# EAGLE schematic radio_module (EAGLE 6.6.0)
AUTHOR: Joshua Adkins; REV: A; TITLE: Radio Module

## Sheet 1 of 5
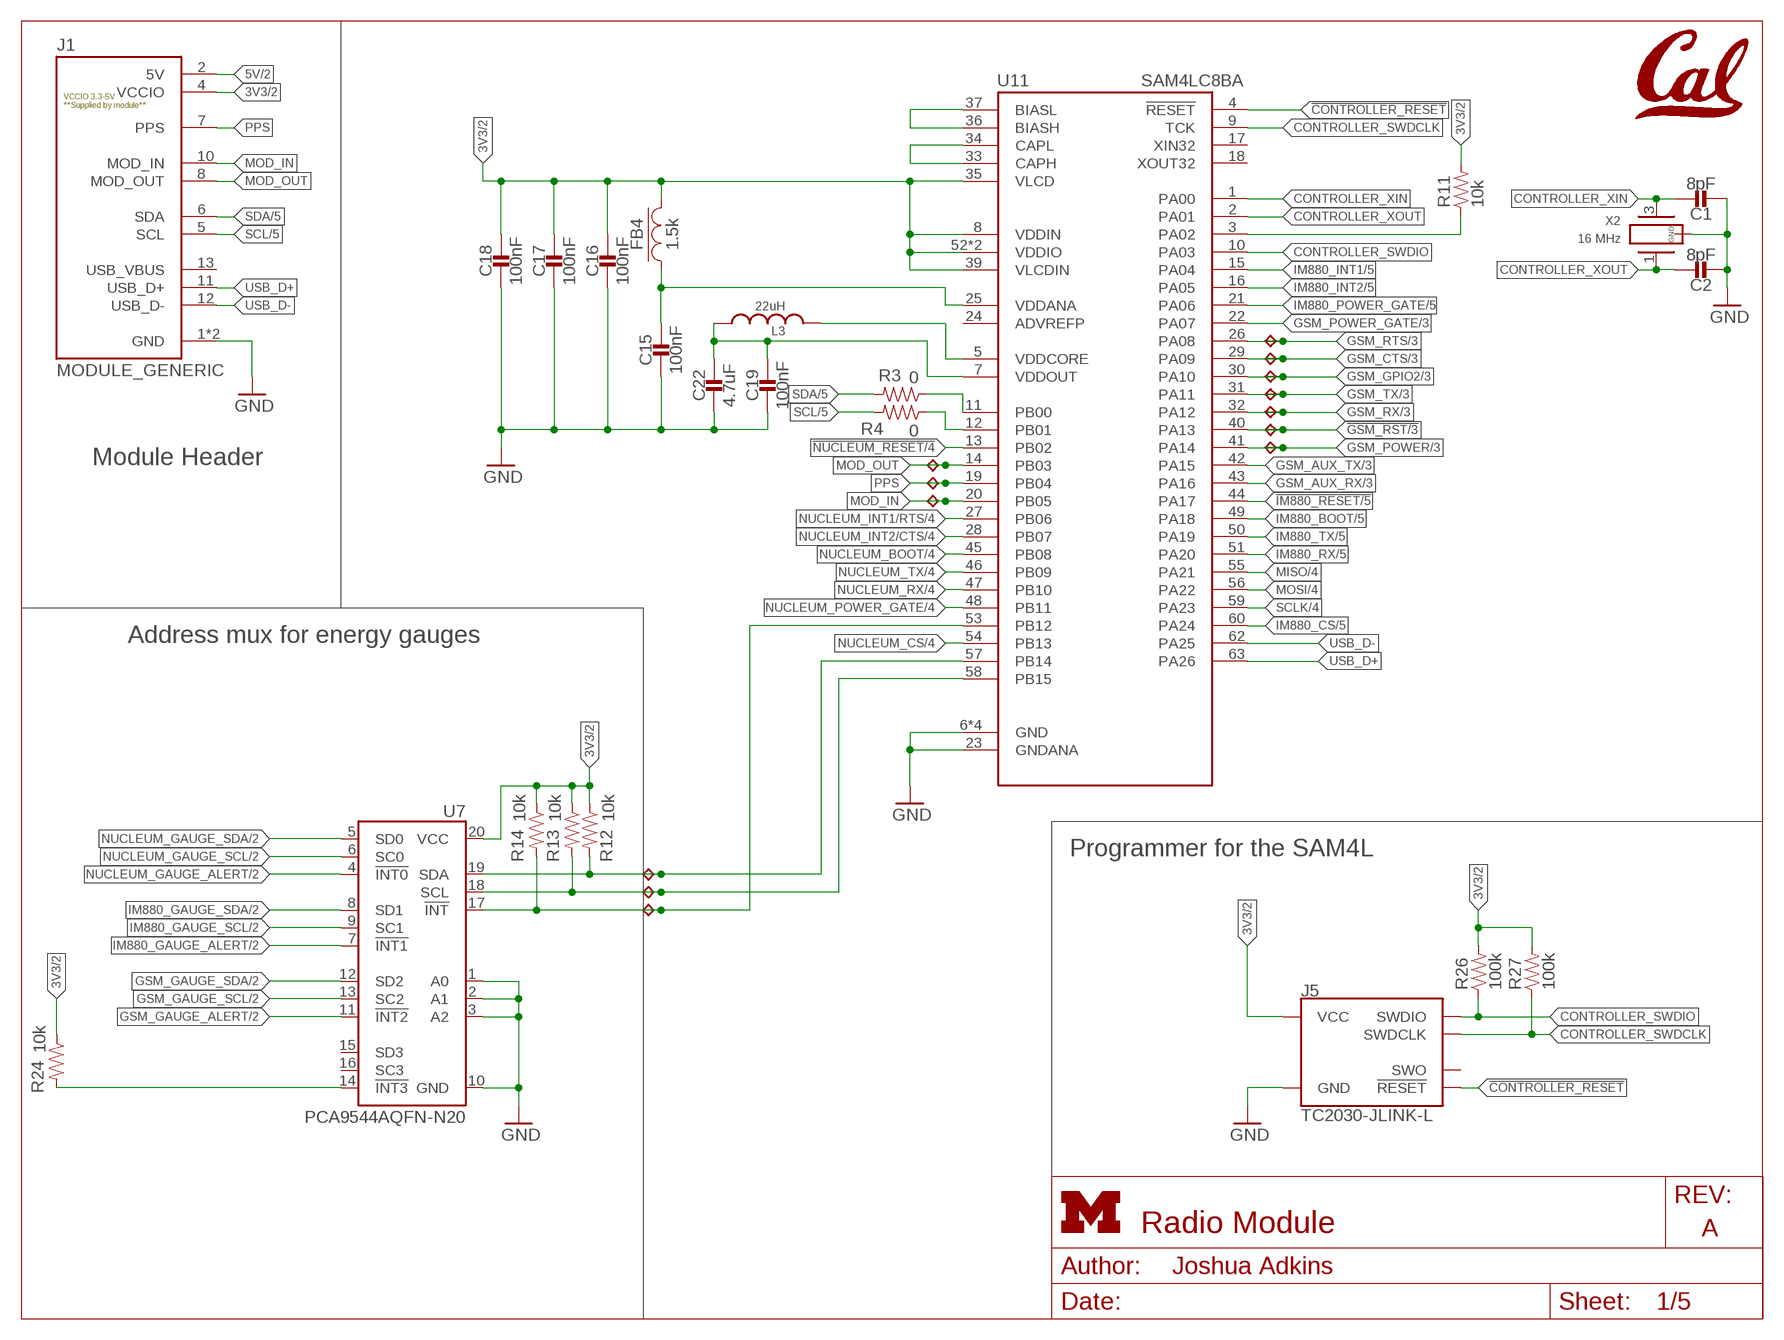
[diagram p0: schematic, sheet 1]
FRAME2 (LETTER_L_UMICH): HEIGHT: 8.5in; WIDTH: 11in

### Parts
C1  8pF  CAPACITOR0402_CAP  [0402_CAP]
C2  8pF  CAPACITOR0402_CAP  [0402_CAP]
C15  100nF  CAPACITOR0402_CAP  [0402_CAP]
C16  100nF  CAPACITOR0402_CAP  [0402_CAP]
C17  100nF  CAPACITOR0402_CAP  [0402_CAP]
C18  100nF  CAPACITOR0402_CAP  [0402_CAP]
C19  100nF  CAPACITOR0402_CAP  [0402_CAP]
C22  4.7uF  CAPACITOR0402_CAP  [0402_CAP]
FB4  1.5k  FERRITE_BEAD0402  [0402_CAP]
J1  MODULE_GENERIC  [MODULE_GENERIC]
J5  TC2030-JLINK-L  [TC2030-IDC]
L3  22uH  LHQ3NP  [1212]
R3  0  RESISTOR0402_RES  [0402_RES]
R4  0  RESISTOR0402_RES  [0402_RES]
R11  10k  RESISTOR0402_RES  [0402_RES]
R12  10k  RESISTOR0402_RES  [0402_RES]
R13  10k  RESISTOR0402_RES  [0402_RES]
R14  10k  RESISTOR0402_RES  [0402_RES]
R24  10k  RESISTOR0402_RES  [0402_RES]
R26  100k  RESISTOR0402_RES  [0402_RES]
R27  100k  RESISTOR0402_RES  [0402_RES]
TP1  TPB1,27  [B1,27]
TP2  TPB1,27  [B1,27]
TP3  TPB1,27  [B1,27]
TP4  TPB1,27  [B1,27]
TP5  TPB1,27  [B1,27]
TP6  TPB1,27  [B1,27]
TP7  TPB1,27  [B1,27]
TP8  TPB1,27  [B1,27]
TP9  TPB1,27  [B1,27]
TP10  TPB1,27  [B1,27]
TP11  TPB1,27  [B1,27]
TP12  TPB1,27  [B1,27]
TP13  TPB1,27  [B1,27]
U7  PCA9544AQFN-N20  [QFN-N20]
U11  SAM4LC8BA  [QFN-64-9MM]
U$1  UCB_CAL100MIL  [UCB_CAL_100MIL]
X2  16 MHz  FH1600015  [FHXXX]

### Nets
3V3: C16.1 C17.1 C18.1 FB4.2 J1.4(VCCIO) J5.1(VCC) R11.2 R12.1 R13.1 R14.1 R24.1 R26.2 R27.2 U7.20(VCC) U11.8(VDDIN) U11.35(VLCD) U11.39(VLCDIN) U11.52(VDDIO) U11.61(VDDIO) ; also sheet 2,3
5V: J1.2(5V) ; also sheet 2
!CONTROLLER_RESET: J5.3(!RESET) U11.4(!RESET)
!GSM_RST: TP7.TP U11.40(PA13) ; also sheet 3
!IM880_RESET: U11.44(PA17) ; also sheet 5
!NUCLEUM_RESET: U11.13(PB02) ; also sheet 4
CONTROLLER_BUCK/LDO_N: R11.1 U11.3(PA02)
CONTROLLER_SWDCLK: J5.4(SWDCLK) R27.1 U11.9(TCK)
CONTROLLER_SWDIO: J5.2(SWDIO) R26.1 U11.10(PA03)
CONTROLLER_XIN: C1.1 U11.1(PA00) X2.3
CONTROLLER_XOUT: C2.1 U11.2(PA01) X2.1
GND: C1.2 C2.2 C15.2 C16.2 C17.2 C18.2 C19.2 C22.2 J1.1(GND) J1.14(GND) J5.5(GND) U7.1(A0) U7.2(A1) U7.3(A2) U7.10(GND) U11.6(GND) U11.23(GNDANA) U11.38(GND) U11.64(GND) U11.GND X2.2(GND) X2.4(GND) ; also sheet 2,3,4,5
GSM_AUX_RX: U11.43(PA16) ; also sheet 3
GSM_AUX_TX: U11.42(PA15) ; also sheet 3
GSM_CTS: TP11.TP U11.29(PA09) ; also sheet 3
GSM_GAUGE_ALERT: U7.11(!INT2) ; also sheet 2
GSM_GAUGE_SCL: U7.13(SC2) ; also sheet 2
GSM_GAUGE_SDA: U7.12(SD2) ; also sheet 2
GSM_GPIO2: TP10.TP U11.30(PA10) ; also sheet 3
GSM_POWER: TP6.TP U11.41(PA14) ; also sheet 3
GSM_POWER_GATE: U11.22(PA07) ; also sheet 3
GSM_RTS: TP12.TP U11.26(PA08) ; also sheet 3
GSM_RX: TP8.TP U11.32(PA12) ; also sheet 3
GSM_TX: TP9.TP U11.31(PA11) ; also sheet 3
IM880_BOOT: U11.49(PA18) ; also sheet 5
IM880_CS: U11.60(PA24) ; also sheet 5
IM880_GAUGE_ALERT: U7.7(!INT1) ; also sheet 2
IM880_GAUGE_SCL: U7.9(SC1) ; also sheet 2
IM880_GAUGE_SDA: U7.8(SD1) ; also sheet 2
IM880_INT1: U11.15(PA04) ; also sheet 5
IM880_INT2: U11.16(PA05) ; also sheet 5
IM880_POWER_GATE: U11.21(PA06) ; also sheet 5
IM880_RX: U11.51(PA20) ; also sheet 5
IM880_TX: U11.50(PA19) ; also sheet 5
MISO: U11.55(PA21) ; also sheet 4,5
MOD_IN: J1.10(MOD_IN) TP3.TP U11.20(PB05)
MOD_OUT: J1.8(MOD_OUT) TP1.TP U11.14(PB03)
MOSI: U11.56(PA22) ; also sheet 4,5
N$9: R14.2 TP13.TP U7.17(!INT) U11.53(PB12)
N$12: R24.2 U7.14(!INT3)
N$17: R3.1 U11.11(PB00)
N$18: R4.1 U11.12(PB01)
N$33: C15.1 FB4.1 U11.25(VDDANA)
N$44: C19.1 C22.1 L3.P$1 U11.7(VDDOUT)
N$52: L3.P$2 U11.5(VDDCORE)
N$53: U11.36(BIASH) U11.37(BIASL)
N$54: U11.33(CAPH) U11.34(CAPL)
NUCLEUM_BOOT: U11.45(PB08) ; also sheet 4
NUCLEUM_CS: U11.54(PB13) ; also sheet 4
NUCLEUM_GAUGE_ALERT: U7.4(!INT0) ; also sheet 2
NUCLEUM_GAUGE_SCL: U7.6(SC0) ; also sheet 2
NUCLEUM_GAUGE_SDA: U7.5(SD0) ; also sheet 2
NUCLEUM_INT1/RTS: U11.27(PB06) ; also sheet 4
NUCLEUM_INT2/CTS: U11.28(PB07) ; also sheet 4
NUCLEUM_POWER_GATE: U11.48(PB11) ; also sheet 4
NUCLEUM_RX: U11.47(PB10) ; also sheet 4
NUCLEUM_TX: U11.46(PB09) ; also sheet 4
PPS: J1.7(PPS) TP2.TP U11.19(PB04)
SCL: J1.5(SCL) R4.2 ; also sheet 5
SCL_INTERNAL: R13.2 TP5.TP U7.18(SCL) U11.58(PB15)
SCLK: U11.59(PA23) ; also sheet 4,5
SDA: J1.6(SDA) R3.2 ; also sheet 5
SDA_INTERNAL: R12.2 TP4.TP U7.19(SDA) U11.57(PB14)
USB_D+: J1.11(USB_D+) U11.63(PA26)
USB_D-: J1.12(USB_D-) U11.62(PA25)
Unconnected: J1.13(USB_VBUS) J5.6(SWO) U7.15(SD3) U7.16(SC3) U11.17(XIN32) U11.18(XOUT32)

### Notes on the sheet
- Module Header
- Address mux for energy gauges
- Programmer for the SAM4L

## Sheet 2 of 5
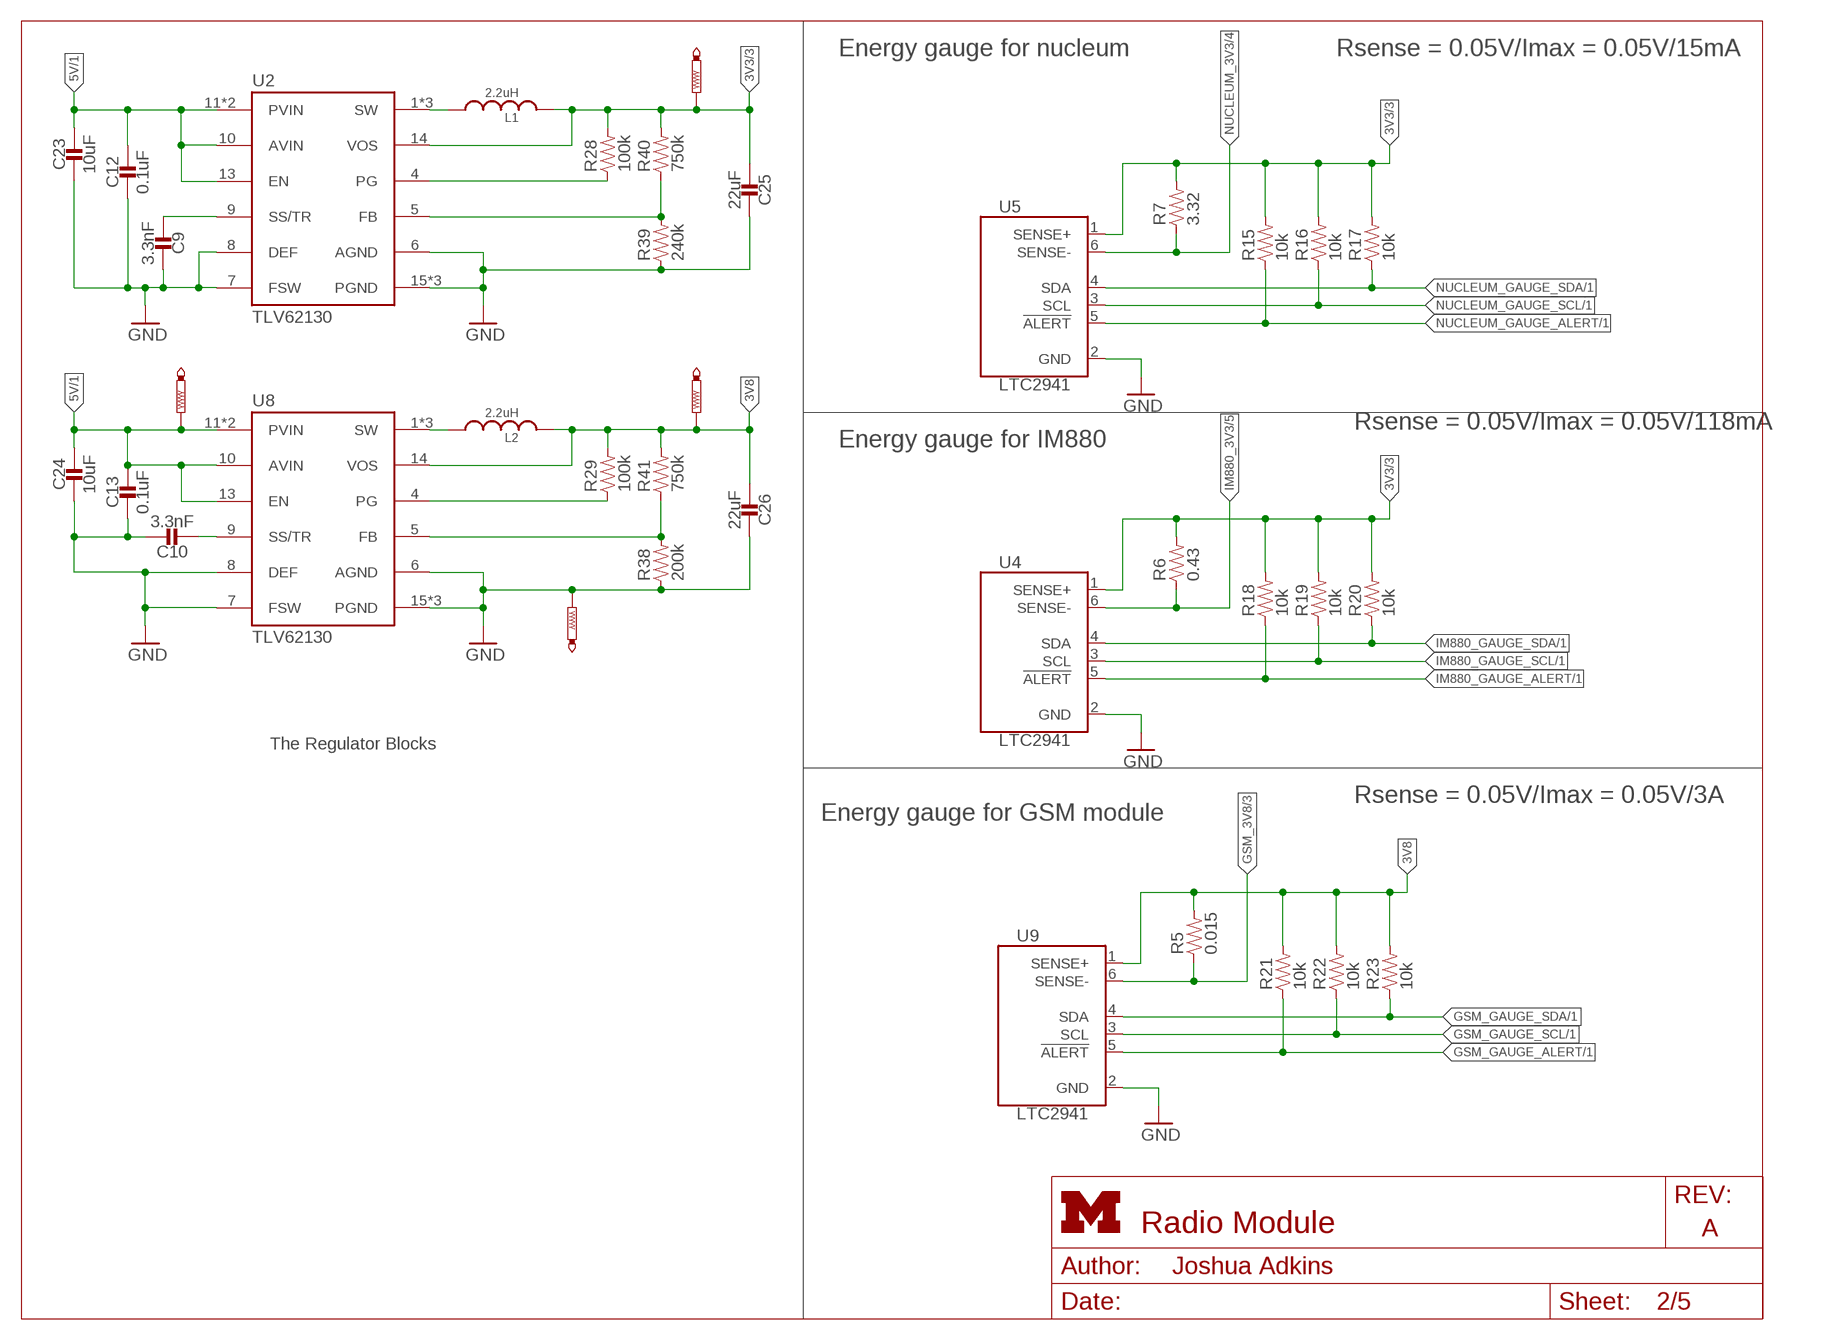
[diagram p1: schematic, sheet 2]
FRAME5 (LETTER_L_UMICH): HEIGHT: 8.5in; WIDTH: 11in

### Parts
C9  3.3nF  CAPACITOR0402_CAP  [0402_CAP]
C10  3.3nF  CAPACITOR0402_CAP  [0402_CAP]
C12  0.1uF  CAPACITOR0402_CAP  [0402_CAP]
C13  0.1uF  CAPACITOR0402_CAP  [0402_CAP]
C23  10uF  CAPACITOR0402_CAP  [0402_CAP]
C24  10uF  CAPACITOR0402_CAP  [0402_CAP]
C25  22uF  CAPACITOR0402_CAP  [0402_CAP]
C26  22uF  CAPACITOR0402_CAP  [0402_CAP]
L1  2.2uH  INDUCTORIHL  [IHL-1212BZ-11]
L2  2.2uH  INDUCTORIHL  [IHL-1212BZ-11]
R5  0.015  RESISTOR0603_RES  [0603-RES]
R6  0.43  RESISTOR0402_RES  [0402_RES]
R7  3.32  RESISTOR0402_RES  [0402_RES]
R15  10k  RESISTOR0402_RES  [0402_RES]
R16  10k  RESISTOR0402_RES  [0402_RES]
R17  10k  RESISTOR0402_RES  [0402_RES]
R18  10k  RESISTOR0402_RES  [0402_RES]
R19  10k  RESISTOR0402_RES  [0402_RES]
R20  10k  RESISTOR0402_RES  [0402_RES]
R21  10k  RESISTOR0402_RES  [0402_RES]
R22  10k  RESISTOR0402_RES  [0402_RES]
R23  10k  RESISTOR0402_RES  [0402_RES]
R28  100k  RESISTOR0402_RES  [0402_RES]
R29  100k  RESISTOR0402_RES  [0402_RES]
R38  200k  RESISTOR0402_RES  [0402_RES]
R39  240k  RESISTOR0402_RES  [0402_RES]
R40  750k  RESISTOR0402_RES  [0402_RES]
R41  750k  RESISTOR0402_RES  [0402_RES]
TP14  PTR1PAD1-13  [P1-13]
TP15  PTR1PAD1-13  [P1-13]
TP16  PTR1PAD1-13  [P1-13]
TP17  PTR1PAD1-13  [P1-13]
U2  TLV62130  [TQFN-16/3MM]
U4  LTC2941  [DFN-6-2MMX3MM]
U5  LTC2941  [DFN-6-2MMX3MM]
U8  TLV62130  [TQFN-16/3MM]
U9  LTC2941  [DFN-6-2MMX3MM]

### Nets
3V3: C25.2 L1.P$2 R6.2 R7.2 R15.2 R16.2 R17.2 R18.2 R19.2 R20.2 R28.2 R40.2 TP17.TP U2.14(VOS) U4.1(SENSE+) U5.1(SENSE+) ; also sheet 1,3
3V8: C26.2 L2.P$2 R5.2 R21.2 R22.2 R23.2 R29.2 R41.2 TP14.TP U8.14(VOS) U9.1(SENSE+)
3V8SWOUT: L2.P$1 U8.1(SW) U8.2(SW) U8.3(SW)
3VSWOUT: L1.P$1 U2.1(SW) U2.2(SW) U2.3(SW)
5V: C12.1 C13.1 C23.1 C24.1 TP16.TP U2.10(AVIN) U2.11(PVIN) U2.12(PVIN) U2.13(EN) U8.10(AVIN) U8.11(PVIN) U8.12(PVIN) U8.13(EN) ; also sheet 1
GND: C9.1 C10.1 C12.2 C13.2 C23.2 C24.2 C25.1 C26.1 R38.1 R39.1 TP15.TP U2.6(AGND) U2.7(FSW) U2.8(DEF) U2.15(PGND) U2.16(PGND) U2.GND U4.2(GND) U5.2(GND) U8.6(AGND) U8.7(FSW) U8.8(DEF) U8.15(PGND) U8.16(PGND) U8.GND U9.2(GND) ; also sheet 1,3,4,5
GSM_3V8: R5.1 U9.6(SENSE-) ; also sheet 3
GSM_GAUGE_ALERT: R21.1 U9.5(!ALERT) ; also sheet 1
GSM_GAUGE_SCL: R22.1 U9.3(SCL) ; also sheet 1
GSM_GAUGE_SDA: R23.1 U9.4(SDA) ; also sheet 1
IM880_3V3: R6.1 U4.6(SENSE-) ; also sheet 5
IM880_GAUGE_ALERT: R18.1 U4.5(!ALERT) ; also sheet 1
IM880_GAUGE_SCL: R19.1 U4.3(SCL) ; also sheet 1
IM880_GAUGE_SDA: R20.1 U4.4(SDA) ; also sheet 1
N$34: C9.2 U2.9(SS/TR)
N$36: R28.1 U2.4(PG)
N$37: R39.2 R40.1 U2.5(FB)
N$38: C10.2 U8.9(SS/TR)
N$40: R29.1 U8.4(PG)
N$41: R38.2 R41.1 U8.5(FB)
NUCLEUM_3V3: R7.1 U5.6(SENSE-) ; also sheet 4
NUCLEUM_GAUGE_ALERT: R15.1 U5.5(!ALERT) ; also sheet 1
NUCLEUM_GAUGE_SCL: R16.1 U5.3(SCL) ; also sheet 1
NUCLEUM_GAUGE_SDA: R17.1 U5.4(SDA) ; also sheet 1

### Notes on the sheet
- Energy gauge for nucleum | Rsense = 0.05V/Imax = 0.05V/15mA
- Rsense = 0.05V/Imax = 0.05V/118mA
- Energy gauge for IM880
- The Regulator Blocks
- Rsense = 0.05V/Imax = 0.05V/3A
- Energy gauge for GSM module

## Sheet 3 of 5
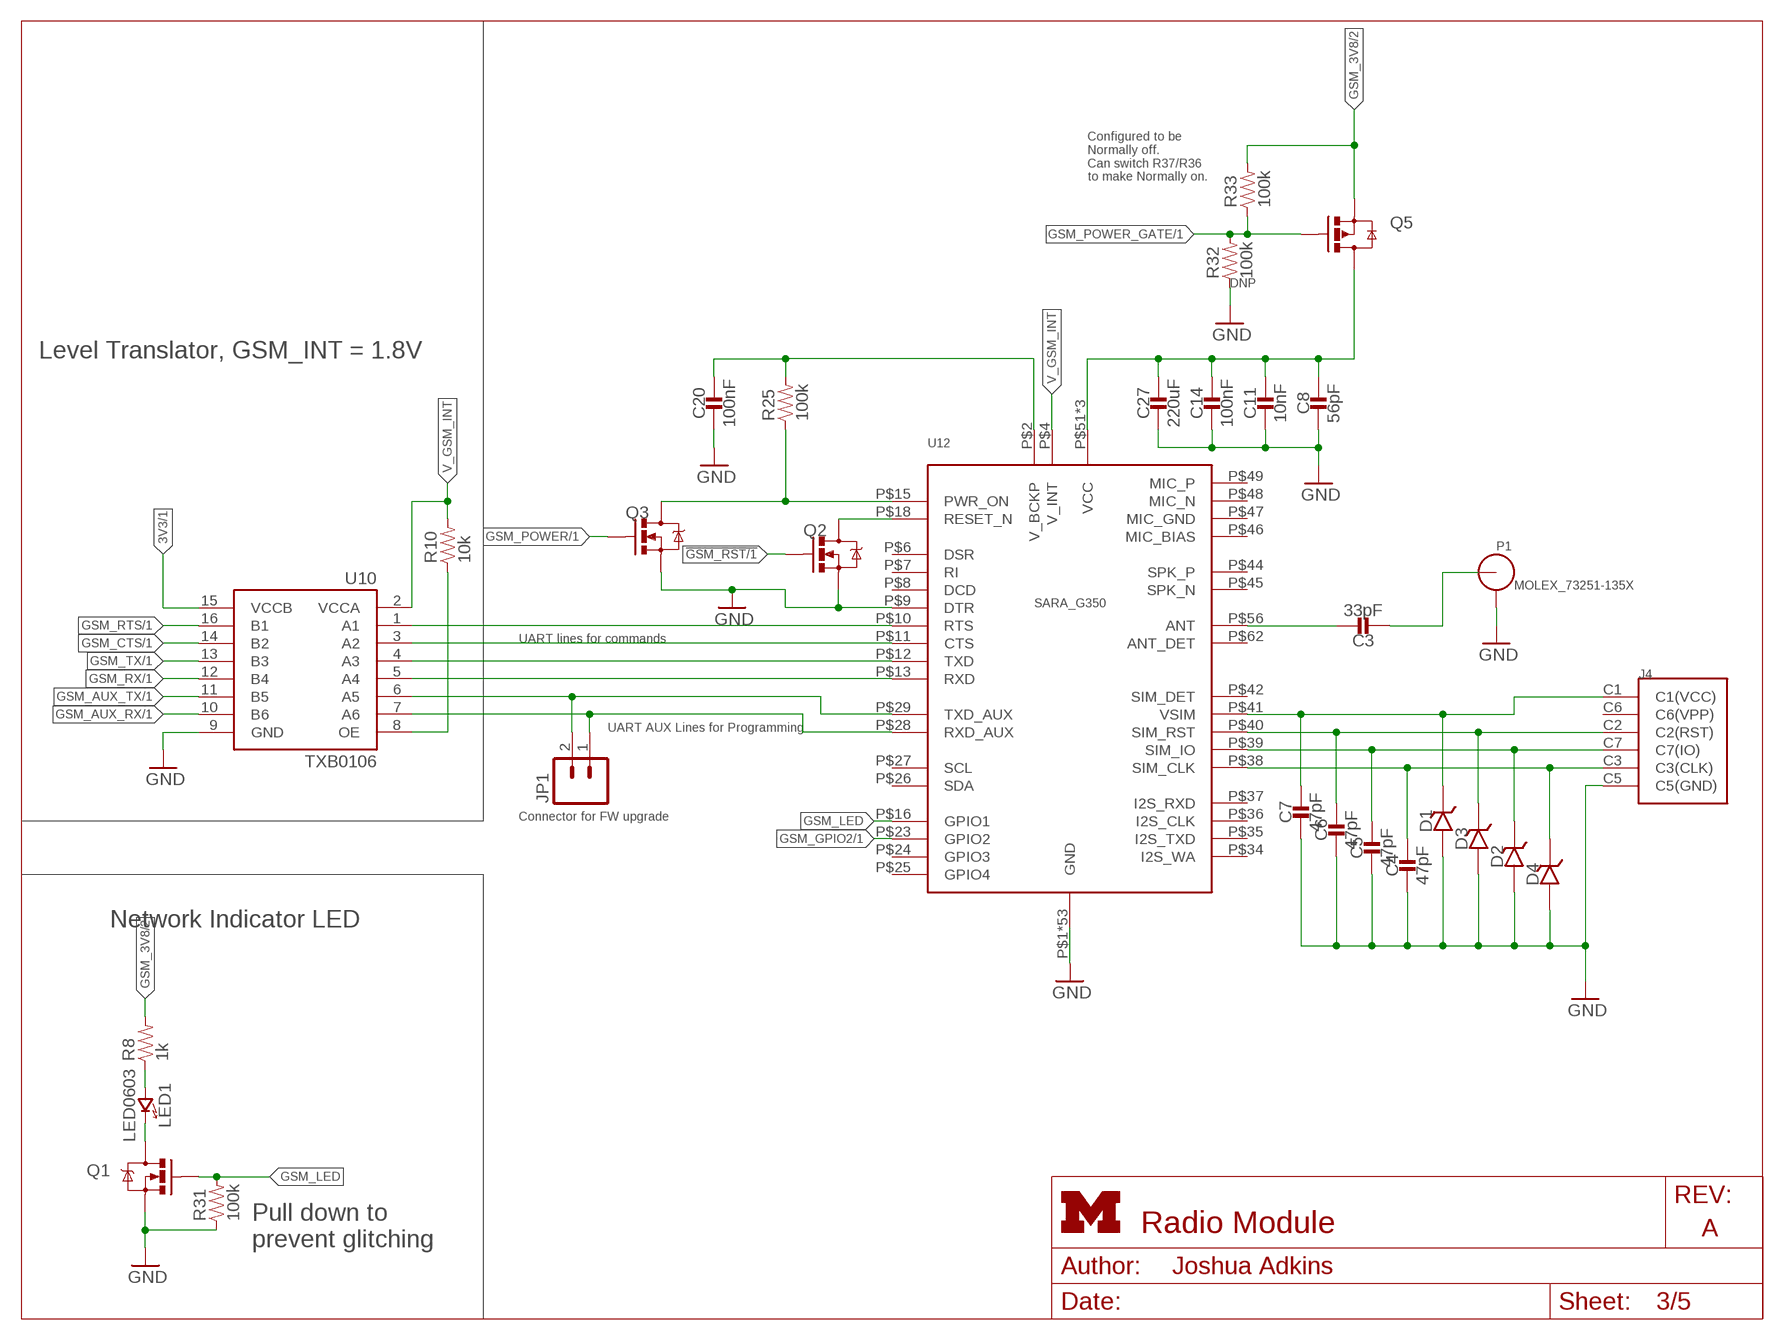
[diagram p2: schematic, sheet 3]
FRAME1 (LETTER_L_UMICH): HEIGHT: 8.5in; WIDTH: 11in

### Parts
C3  33pF  CAPACITOR0603_CAP  [0603_CAP]
C4  47pF  CAPACITOR0402_CAP  [0402_CAP]
C5  47pF  CAPACITOR0402_CAP  [0402_CAP]
C6  47pF  CAPACITOR0402_CAP  [0402_CAP]
C7  47pF  CAPACITOR0402_CAP  [0402_CAP]
C8  56pF  CAPACITOR0402_CAP  [0402_CAP]
C11  10nF  CAPACITOR0402_CAP  [0402_CAP]
C14  100nF  CAPACITOR0402_CAP  [0402_CAP]
C20  100nF  CAPACITOR0402_CAP  [0402_CAP]
C27  220uF  CAPACITOR1210_CAP  [1210_CAP]
D1  14V  DIODE_ZENER  [0402_DIODE]
D2  DIODE_ZENER  [0402_DIODE]
D3  DIODE_ZENER  [0402_DIODE]
D4  DIODE_ZENER  [0402_DIODE]
J4  NANO_SIM  [WURTH_NANO_SIM]
JP1  M02PTH  [1X02]
LED1  LED0603  [LED-0603]
P1  MOLEX_73251-135X  [SMA-J/PCB]
Q1  MOSFET-NCHANNELXFDN-3  [XFDFN-3]
Q2  MOSFET-NCHANNELXFDN-3  [XFDFN-3]
Q3  MOSFET-NCHANNELXFDN-3  [XFDFN-3]
Q5  SI223DDS  [SOT23-3]
R8  1k  RESISTOR0402_RES  [0402_RES]
R10  10k  RESISTOR0402_RES  [0402_RES]
R25  100k  RESISTOR0402_RES  [0402_RES]
R31  100k  RESISTOR0402_RES  [0402_RES]
R32  100k  RESISTOR0402_RES  [0402_RES]
R33  100k  RESISTOR0402_RES  [0402_RES]
U10  TXB0106  [R-PVQFN-N16]
U12  UBLOX_SARA_G350  [UBLOX_SARA_G3]

### Nets
3V3: U10.15(VCCB) ; also sheet 1,2
!GSM_RST: Q2.G ; also sheet 1
GND: C4.2 C5.2 C6.2 C7.2 C8.2 C11.2 C14.2 C20.2 C27.2 D1.ANODE D2.ANODE D3.ANODE D4.ANODE J4.C5(C5(GND)) P1.2 P1.3 P1.4 P1.5 Q1.S Q2.S Q3.S R31.1 R32.1 U10.9(GND) U12.P65(GND) U12.P66(GND) U12.P67(GND) U12.P68(GND) U12.P69(GND) U12.P70(GND) U12.P71(GND) U12.P72(GND) U12.P73(GND) U12.P74(GND) U12.P75(GND) U12.P76(GND) U12.P77(GND) U12.P78(GND) U12.P79(GND) U12.P80(GND) U12.P81(GND) U12.P82(GND) U12.P83(GND) U12.P84(GND) U12.P85(GND) U12.P86(GND) U12.P87(GND) U12.P88(GND) U12.P89(GND) U12.P90(GND) U12.P91(GND) U12.P92(GND) U12.P93(GND) U12.P94(GND) U12.P95(GND) U12.P96(GND) U12.P$1(GND) U12.P$3(GND) U12.P$5(GND) U12.P$9(DTR) U12.P$14(GND) U12.P$20(GND) U12.P$21(GND) U12.P$22(GND) U12.P$30(GND) U12.P$32(GND) U12.P$33(GND) U12.P$43(GND) U12.P$50(GND) U12.P$54(GND) U12.P$55(GND) U12.P$57(GND) U12.P$58(GND) U12.P$59(GND) U12.P$60(GND) U12.P$61(GND) U12.P$63(GND) U12.P$64(GND) ; also sheet 1,2,4,5
GSM_3V8: Q5.2(S) R8.2 R33.2 ; also sheet 2
GSM_AUX_RX: U10.10(B6) ; also sheet 1
GSM_AUX_TX: U10.11(B5) ; also sheet 1
GSM_CTS: U10.14(B2) ; also sheet 1
GSM_GATED: C8.1 C11.1 C14.1 C27.1 Q5.3(D) U12.P$51(VCC) U12.P$52(VCC) U12.P$53(VCC)
GSM_GPIO2: U12.P$23(GPIO2) ; also sheet 1
GSM_LED: Q1.G R31.2 U12.P$16(GPIO1)
GSM_POWER: Q3.G ; also sheet 1
GSM_POWER_GATE: Q5.1(G) R32.2 R33.1 ; also sheet 1
GSM_RTS: U10.16(B1) ; also sheet 1
GSM_RX: U10.12(B4) ; also sheet 1
GSM_TX: U10.13(B3) ; also sheet 1
N$1: C7.1 D1.CATHODE J4.C1(C1(VCC)) U12.P$41(VSIM)
N$2: C6.1 D3.CATHODE J4.C2(C2(RST)) U12.P$40(SIM_RST)
N$3: C5.1 D2.CATHODE J4.C7(C7(IO)) U12.P$39(SIM_IO)
N$4: C4.1 D4.CATHODE J4.C3(C3(CLK)) U12.P$38(SIM_CLK)
N$5: R10.1 U10.8(OE)
N$6: C3.1 U12.P$56(ANT)
N$7: C3.2 P1.1(ANT)
N$8: LED1.A(ANODE) R8.1
N$10: U10.4(A3) U12.P$12(TXD)
N$11: U10.5(A4) U12.P$13(RXD)
N$13: LED1.C(CATHODE) Q1.D
N$14: Q2.D U12.P$18(RESET_N)
N$15: C20.1 R25.2 U12.P$2(V_BCKP)
N$16: Q3.D R25.1 U12.P$15(PWR_ON)
N$20: JP1.2 U10.6(A5) U12.P$29(TXD_AUX)
N$21: JP1.1 U10.7(A6) U12.P$28(RXD_AUX)
N$22: U10.3(A2) U12.P$11(CTS)
N$23: U10.1(A1) U12.P$10(RTS)
V_GSM_INT: R10.2 U10.2(VCCA) U12.P$4(V_INT)
Unconnected: J4.C6(C6(VPP)) U12.P$6(DSR) U12.P$7(RI) U12.P$8(DCD) U12.P$24(GPIO3) U12.P$25(GPIO4) U12.P$26(SDA) U12.P$27(SCL) U12.P$34(I2S_WA) U12.P$35(I2S_TXD) U12.P$36(I2S_CLK) U12.P$37(I2S_RXD) U12.P$42(SIM_DET) U12.P$44(SPK_P) U12.P$45(SPK_N) U12.P$46(MIC_BIAS) U12.P$47(MIC_GND) U12.P$48(MIC_N) U12.P$49(MIC_P) U12.P$62(ANT_DET)

### Notes on the sheet
- Configured to be
  Normally off.
  Can switch R37/R36 
  to make Normally on.
- DNP
- Level Translator, GSM_INT = 1.8V
- UART lines for commands
- UART AUX Lines for Programming
- Connector for FW upgrade
- Network Indicator LED
- Pull down to 
  prevent glitching

## Sheet 4 of 5
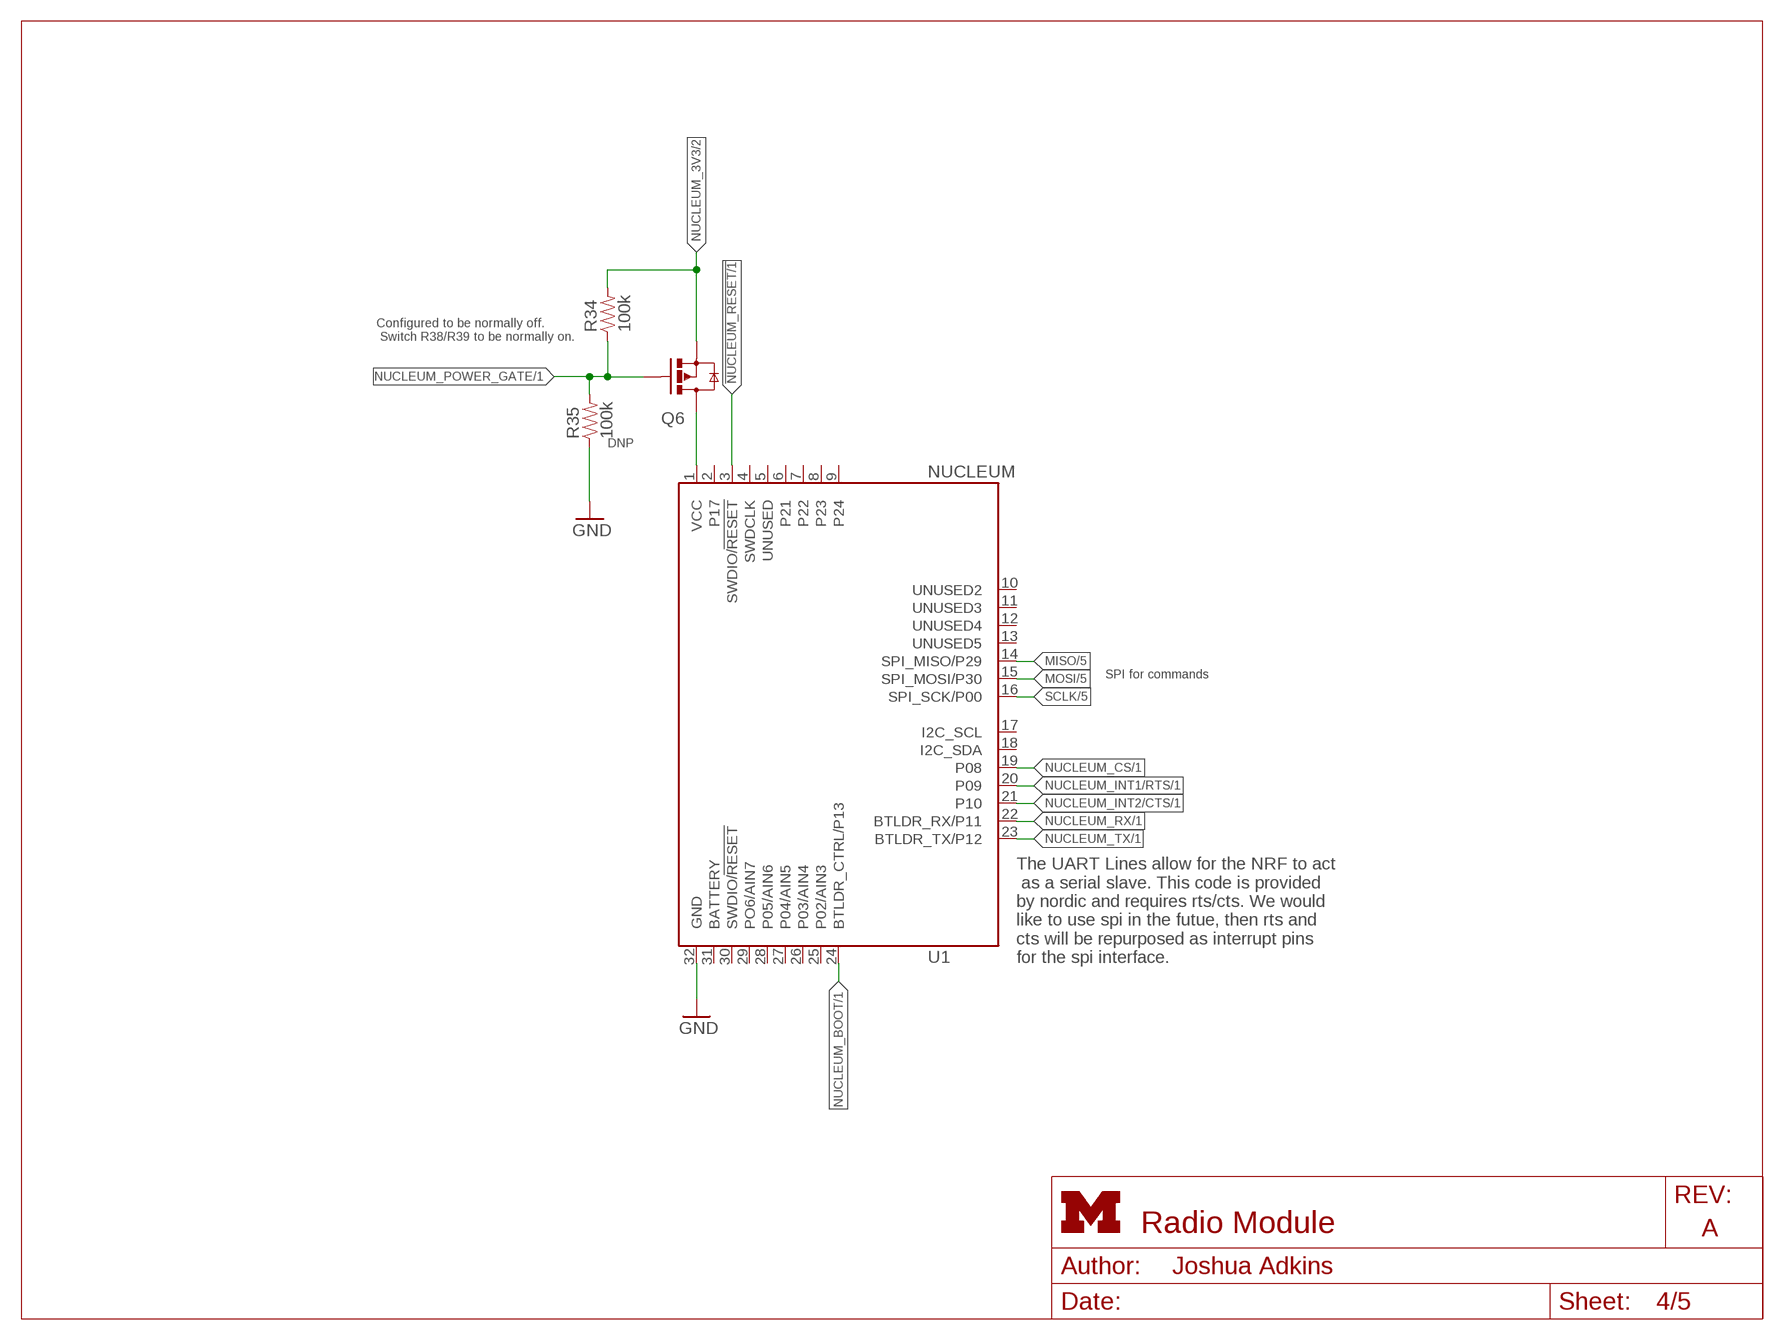
[diagram p3: schematic, sheet 4]
FRAME3 (LETTER_L_UMICH): HEIGHT: 8.5in; WIDTH: 11in

### Parts
Q6  SI223DDS  [SOT23-3]
R34  100k  RESISTOR0402_RES  [0402_RES]
R35  100k  RESISTOR0402_RES  [0402_RES]
U1  NUCLEUM  [NUCLEUM]

### Nets
!NUCLEUM_RESET: U1.3(SWDIO/!RESET) ; also sheet 1
GND: R35.1 U1.32(GND) ; also sheet 1,2,3,5
MISO: U1.14(SPI_MISO/P29) ; also sheet 1,5
MOSI: U1.15(SPI_MOSI/P30) ; also sheet 1,5
N$19: Q6.3(D) U1.1(VCC)
NUCLEUM_3V3: Q6.2(S) R34.2 ; also sheet 2
NUCLEUM_BOOT: U1.24(BTLDR_CTRL/P13) ; also sheet 1
NUCLEUM_CS: U1.19(P08) ; also sheet 1
NUCLEUM_INT1/RTS: U1.20(P09) ; also sheet 1
NUCLEUM_INT2/CTS: U1.21(P10) ; also sheet 1
NUCLEUM_POWER_GATE: Q6.1(G) R34.1 R35.2 ; also sheet 1
NUCLEUM_RX: U1.22(BTLDR_RX/P11) ; also sheet 1
NUCLEUM_TX: U1.23(BTLDR_TX/P12) ; also sheet 1
SCLK: U1.16(SPI_SCK/P00) ; also sheet 1,5
Unconnected: U1.2(P17) U1.4(SWDCLK) U1.5(UNUSED) U1.6(P21) U1.7(P22) U1.8(P23) U1.9(P24) U1.10(UNUSED2) U1.11(UNUSED3) U1.12(UNUSED4) U1.13(UNUSED5) U1.17(I2C_SCL) U1.18(I2C_SDA) U1.25(P02/AIN3) U1.26(P03/AIN4) U1.27(P04/AIN5) U1.28(P05/AIN6) U1.29(PO6/AIN7) U1.30(SWDIO/!RESET) U1.31(BATTERY)

### Notes on the sheet
- Configured to be normally off.
   Switch R38/R39 to be normally on.
- DNP
- SPI for commands
- The UART Lines allow for the NRF to act
   as a serial slave. This code is provided 
  by nordic and requires rts/cts. We would 
  like to use spi in the futue, then rts and 
  cts will be repurposed as interrupt pins 
  for the spi interface.

## Sheet 5 of 5
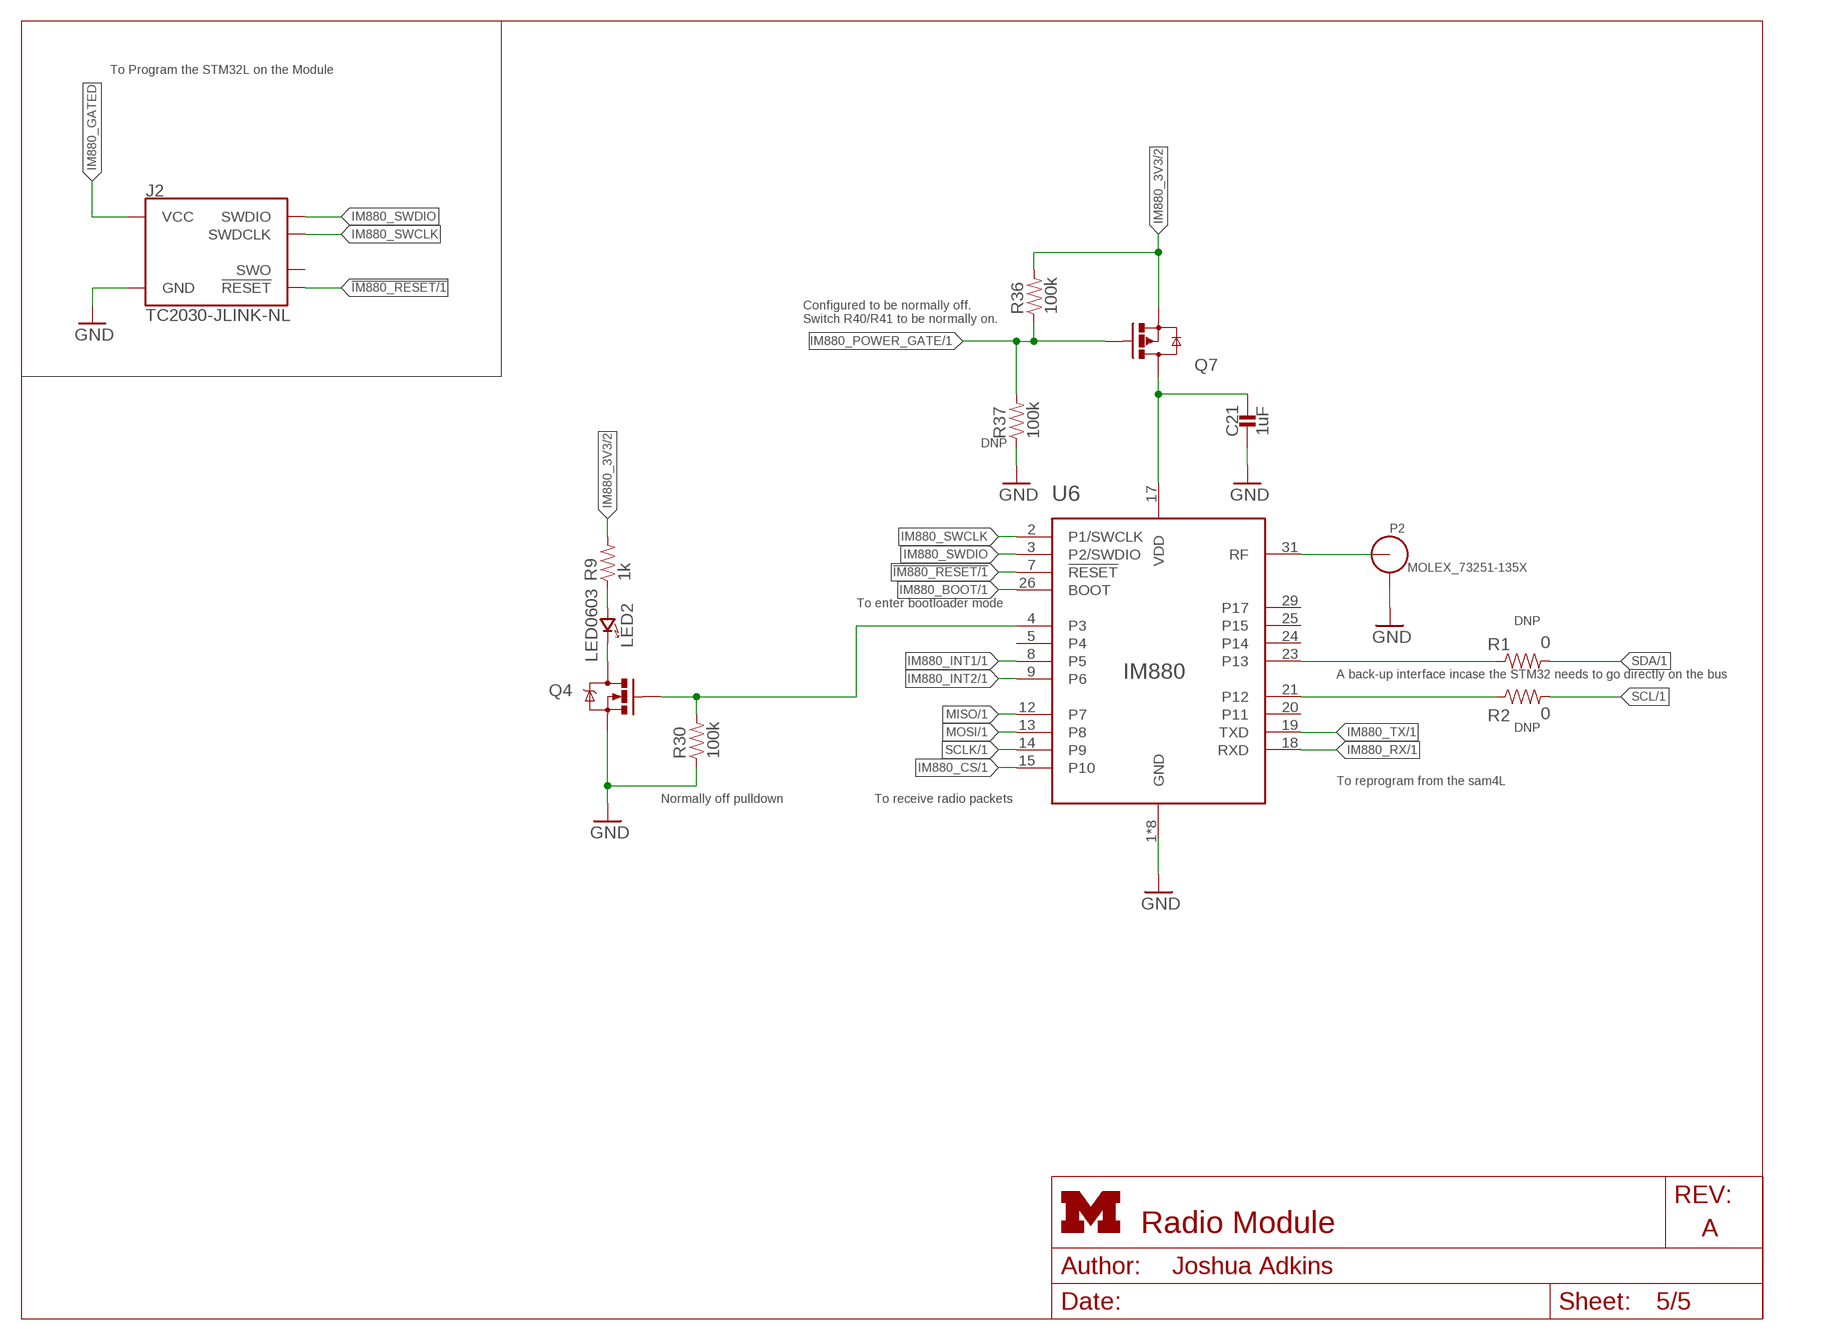
[diagram p4: schematic, sheet 5]
FRAME4 (LETTER_L_UMICH): HEIGHT: 8.5in; WIDTH: 11in

### Parts
C21  1uF  CAPACITOR0402_CAP  [0402_CAP]
J2  TC2030-JLINK-NL  [TC2030-IDC-NL]
LED2  LED0603  [LED-0603]
P2  MOLEX_73251-135X  [SMA-J/PCB]
Q4  MOSFET-NCHANNELXFDN-3  [XFDFN-3]
Q7  SI223DDS  [SOT23-3]
R1  0  RESISTOR0402_RES  [0402_RES]
R2  0  RESISTOR0402_RES  [0402_RES]
R9  1k  RESISTOR0402_RES  [0402_RES]
R30  100k  RESISTOR0402_RES  [0402_RES]
R36  100k  RESISTOR0402_RES  [0402_RES]
R37  100k  RESISTOR0402_RES  [0402_RES]
U6  IM880_MODULE  [IM880_MODULE]

### Nets
!IM880_RESET: J2.3(!RESET) U6.7(!RESET) ; also sheet 1
GND: C21.2 J2.5(GND) P2.2 P2.3 P2.4 P2.5 Q4.S R30.1 R37.1 U6.1(GND) U6.6(GND) U6.11(GND) U6.16(GND) U6.22(GND) U6.27(GND) U6.30(GND) U6.32(GND) ; also sheet 1,2,3,4
IM880_3V3: Q7.2(S) R9.2 R36.2 ; also sheet 2
IM880_BOOT: U6.26(BOOT) ; also sheet 1
IM880_CS: U6.15(P10) ; also sheet 1
IM880_GATED: C21.1 J2.1(VCC) Q7.3(D) U6.17(VDD)
IM880_INT1: U6.8(P5) ; also sheet 1
IM880_INT2: U6.9(P6) ; also sheet 1
IM880_NETWORK: Q4.G R30.2 U6.4(P3)
IM880_POWER_GATE: Q7.1(G) R36.1 R37.2 ; also sheet 1
IM880_RX: U6.18(RXD) ; also sheet 1
IM880_SWCLK: J2.4(SWDCLK) U6.2(P1/SWCLK)
IM880_SWDIO: J2.2(SWDIO) U6.3(P2/SWDIO)
IM880_TX: U6.19(TXD) ; also sheet 1
MISO: U6.12(P7) ; also sheet 1,4
MOSI: U6.13(P8) ; also sheet 1,4
N$24: P2.1(ANT) U6.31(RF)
N$25: R1.1 U6.23(P13)
N$26: R2.1 U6.21(P12)
N$27: LED2.A(ANODE) R9.1
N$28: LED2.C(CATHODE) Q4.D
SCL: R2.2 ; also sheet 1
SCLK: U6.14(P9) ; also sheet 1,4
SDA: R1.2 ; also sheet 1
Unconnected: J2.6(SWO) U6.5(P4) U6.20(P11) U6.24(P14) U6.25(P15) U6.29(P17)

### Notes on the sheet
- To Program the STM32L on the Module
- Configured to be normally off.
  Switch R40/R41 to be normally on.
- DNP
- To enter bootloader mode
- DNP
- A back-up interface incase the STM32 needs to go directly on the bus
- DNP
- To reprogram from the sam4L
- Normally off pulldown | To receive radio packets

## Power pins joined to a net without a drawn wire
ADVREFP: U11.24(ADVREFP)

## Library data of the parts
C1 C2 = passives:CAPACITOR: 0402 Capacitor; DIGIKEY: 490-8230-1-ND
C3-C14 C20 C21 C23-C27 = passives:CAPACITOR: 0402 Capacitor
C15-C19 = passives:CAPACITOR: 0402 Capacitor; DIGIKEY: 490-10777-1-ND
C22 = passives:CAPACITOR: 0402 Capacitor; DIGIKEY: 490-13252-1-ND
D1-D4 = passives:DIODE_ZENER
FB4 = passives:FERRITE_BEAD; DIGIKEY: 490-5216-1-ND
J1 = signpost:MODULE_GENERIC: Module header and PCB guildes for signposts; DIGIKEY: S9170-ND
J2 J5 = connector:TC2030-JLINK
J4 = signpost:NANO_SIM: WURTH Nano SIM Connector; DIGIKEY: 732-5954-1-ND
JP1 = SparkFun-Connectors:M02: Header 2 Standard 2-pin 0.1" header. Use with straight break away headers (SKU : PRT-00116), right angle break away headers (PRT-00553), swiss pins (PRT-00743), machine pins (PRT-00117), and female headers (PRT-00115). Molex polarized connector foot print use with SKU : PRT-08233 with associated crimp pins and housings.
L1 L2 = passives:INDUCTOR: A very specific inductor; DIGIKEY: 541-1322-1-ND
L3 = signpost:LHQ3NP: LHQ3NP Inductor; DIGIKEY: 490-5350-1-ND
LED1 LED2 = leds:LED: LED
P1 P2 = connector:MOLEX_73251-135X: SMA JACK SMT 50 OHM; DIGIKEY: WM9357-ND
Q1-Q4 = fets:MOSFET-NCHANNEL: Generic NMOS footprint; DIGIKEY: DMN2400UFB4-7DICT-ND
Q5-Q7 = fets:SI223DDS: 6A SOT-23 P Fet; DIGIKEY: SI2333DDS-T1-GE3CT-ND
R1 R2 R5-R10 R15-R23 R25 R28-R41 = passives:RESISTOR: Resistor Basic schematic elements and footprints for 0603, 1206, and PTH resistors.
R3 R4 R11-R14 R24 = passives:RESISTOR: Resistor Basic schematic elements and footprints for 0603, 1206, and PTH resistors.; DIGIKEY: 1276-3431-1-ND
R26 R27 = passives:RESISTOR: Resistor Basic schematic elements and footprints for 0603, 1206, and PTH resistors.; DIGIKEY: 1276-3432-1-ND
TP1-TP13 = testpad:TP: Test pad
TP14-TP17 = testpad:PTR1: TEST PIN
U1 = nucleum:NUCLEUM: Nucleum sensorboard prototyping module.
U2 U8 = chips:TLV62130: High Efficient 3A switching step-down regulator. 1V-5V out, 4V-17V in.; DIGIKEY: 296-35978-1-ND
U4 U5 U9 = signpost:LTC2941: I2C Battery Gas Gauge with External Sense Resistor; DIGIKEY: LTC2941IDCB#TRMPBFCT-ND
U6 = chips:IM880_MODULE: Lora Radio module by IMST
U7 = signpost:PCA9544A: 1-4 I2C/SMBUS Multiplexer with interrupt for power supply coulomb counters; DIGIKEY: 296-20960-1-ND
U10 = chips:TXB0106: 6 channel level translator; DIGIKEY: 296-23868-2-ND
U11 = chips:SAM4LC8BA: SAM4L Microcontroller. 64QFN Package. 512 Flash.; DIGIKEY: ATSAM4LC8BA-MURDKR-ND
U12 = signpost:UBLOX_SARA_G350: Sara G350 2.5G Radio Module
U$1 = logos:UCB_CAL
X2 = crystals:FH1600015: Pericom Type FH 16 MHz 2.5 x 2.0 mm; DIGIKEY: FH1600015CT-ND